# Altium project Metlino.PrjPcb (part 8 of 13)

## Sheet ETH_PHY_RGMII.SchDoc: Metlino
size 420 x 297 mm; CheckedBy: P.Kulik,T.Przywozki,W.Ruclo; Author: G.Kasprowicz; CompanyName: WUT ISE; DrawnBy: G.Kasprowicz; Organization: WUT ISE; Address1: PW ISE; Address2: Nowowiejska 15/19 00-665 Warsaw; Address3: gkasprow@gmail.com; DocumentNumber: 17; Revision: 2; SheetNumber: 17; SheetTotal: 29; ModifiedBy: -; CheckedDate: -; Title2: Ethernet PHY; DivGrp: WUT ISE; Designer: G.Kasprowicz; ModifiedDate: -; ProjectName: Sensor Box
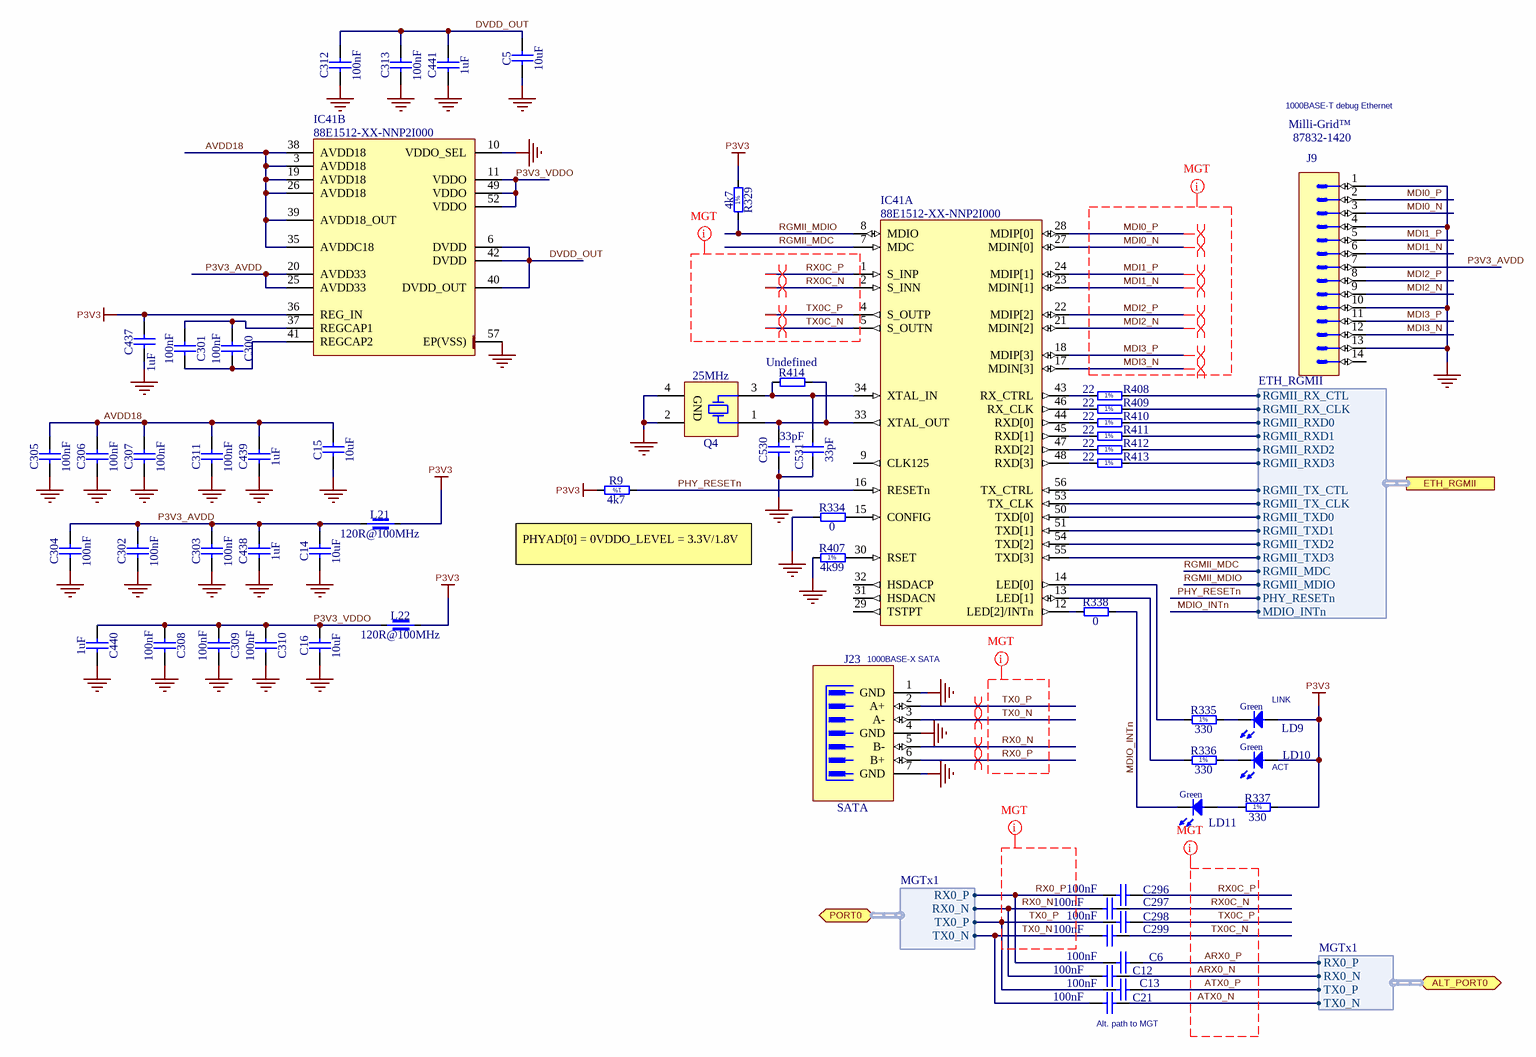
[diagram p16: ETH_PHY_RGMII.SchDoc]

### Parts
C5  10uF  [CAPC1608X87N]
C6  100nF  [CAPC0603X33N]
C12  100nF  [CAPC0603X33N]
C13  100nF  [CAPC0603X33N]
C14  10uF  [CAPC1608X87N]
C15  10uF  [CAPC1608X87N]
C16  10uF  [CAPC1608X87N]
C21  100nF  [CAPC0603X33N]
C296  100nF  [CAPC0603X33N]
C297  100nF  [CAPC0603X33N]
C298  100nF  [CAPC0603X33N]
C299  100nF  [CAPC0603X33N]
C300  100nF  [CAPC0603X33N]
C301  100nF  [CAPC0603X33N]
C302  100nF  [CAPC0603X33N]
C303  100nF  [CAPC0603X33N]
C304  100nF  [CAPC0603X33N]
C305  100nF  [CAPC0603X33N]
C306  100nF  [CAPC0603X33N]
C307  100nF  [CAPC0603X33N]
C308  100nF  [CAPC0603X33N]
C309  100nF  [CAPC0603X33N]
C310  100nF  [CAPC0603X33N]
C311  100nF  [CAPC0603X33N]
C312  100nF  [CAPC0603X33N]
C313  100nF  [CAPC0603X33N]
C437  1uF  [CAPC1005X55N]
C438  1uF  [CAPC1005X55N]
C439  1uF  [CAPC1005X55N]
C440  1uF  [CAPC1005X55N]
C441  1uF  [CAPC1005X55N]
C530  33pF  [CAPC1005X55N]
C531  33pF  [CAPC1005X55N]
IC41  88E1512-XX-NNP2I000  [QFN50P800X800X100-57N-S437]  (parts A,B of 2)
J9  Milli-Grid™  Manufacturer Part Number: 87832-1420  [MOLEX_87832-1420]
J23  SATA  [MOLEX_67800-5005]
L21  120R@100MHz  [INDC1005X55N]
L22  120R@100MHz  [INDC1005X55N]
LD9  Green  [LED_AVAGO_HSME-C120]
LD10  Green  [LED_AVAGO_HSME-C120]
LD11  Green  [LED_AVAGO_HSME-C120]
Q4  25MHz  [XTAL_TXC_8Y]
R9  4k7  [RESC1005X40N]
R329  4k7  [RESC1005X40N]
R334  0  [RESC1005X40N]
R335  330  [RESC1005X40N]
R336  330  [RESC1005X40N]
R337  330  [RESC1005X40N]
R338  0  [RESC1005X40N]
R407  4k99  [RESC1608X55N]
R408  22  [RESC1005X40N]
R409  22  [RESC1005X40N]
R410  22  [RESC1005X40N]
R411  22  [RESC1005X40N]
R412  22  [RESC1005X40N]
R413  22  [RESC1005X40N]
R414  Undefined  [RESC1005X40N]

### Ports
ALT_PORT0 (bidir, harness MGTx1), ETH_RGMII (harness ETH_RGMII), PORT0 (bidir, harness MGTx1)

### Harnesses
MGTx1: RX0_P, RX0_N, TX0_P, TX0_N
ETH_RGMII: RGMII_RX_CTL, RGMII_RX_CLK, RGMII_RXD0, RGMII_RXD1, RGMII_RXD2, RGMII_RXD3, RGMII_TX_CTL, RGMII_TX_CLK, RGMII_TXD0, RGMII_TXD1, RGMII_TXD2, RGMII_TXD3, RGMII_MDC, RGMII_MDIO, PHY_RESETn, MDIO_INTn

### Nets
GND: C5.1 C14.1 C15.1 C16.1 C302.1 C303.1 C304.1 C305.1 C306.1 C307.1 C308.1 C309.1 C310.1 C311.1 C312.1 C313.1 C437.1 C438.1 C439.1 C440.1 C441.1 C530.1 C531.1 IC41.10(VDDO_SEL) IC41.57(EP(VSS)) J9.1 J9.4 J9.10 J9.13 J23.1(GND) J23.4(GND) J23.7(GND) Q4.2(GND) Q4.4(GND) R334.1 R407.1
P3V3: C437.2 IC41.36(REG_IN) L21.2 L22.1 LD9.2(A) LD10.2(A) R9.2 R329.2 R337.2
ARX0_N: C12.2 ; port ALT_PORT0.RX0_N  [project net ALT_PORT0.RX0_N]
ARX0_P: C6.2 ; port ALT_PORT0.RX0_P  [project net ALT_PORT0.RX0_P]
ATX0_N: C21.2 ; port ALT_PORT0.TX0_N  [project net ALT_PORT0.TX0_N]
ATX0_P: C13.2 ; port ALT_PORT0.TX0_P  [project net ALT_PORT0.TX0_P]
AVDD18: C15.2 C305.2 C306.2 C307.2 C311.2 C439.2 IC41.3(AVDD18) IC41.19(AVDD18) IC41.26(AVDD18) IC41.35(AVDDC18) IC41.38(AVDD18) IC41.39(AVDD18_OUT)
DVDD_OUT: C5.2 C312.2 C313.2 C441.2 IC41.6(DVDD) IC41.40(DVDD_OUT) IC41.42(DVDD)
ETH_RGMII.RGMII_RX_CLK: R409.2 ; port ETH_RGMII.RGMII_RX_CLK
ETH_RGMII.RGMII_RX_CTL: R408.2 ; port ETH_RGMII.RGMII_RX_CTL
ETH_RGMII.RGMII_RXD0: R410.2 ; port ETH_RGMII.RGMII_RXD0
ETH_RGMII.RGMII_RXD1: R411.2 ; port ETH_RGMII.RGMII_RXD1
ETH_RGMII.RGMII_RXD2: R412.2 ; port ETH_RGMII.RGMII_RXD2
ETH_RGMII.RGMII_RXD3: R413.2 ; port ETH_RGMII.RGMII_RXD3
ETH_RGMII.RGMII_TX_CLK: IC41.53(TX_CLK) ; port ETH_RGMII.RGMII_TX_CLK
ETH_RGMII.RGMII_TX_CTL: IC41.56(TX_CTRL) ; port ETH_RGMII.RGMII_TX_CTL
ETH_RGMII.RGMII_TXD0: IC41.50(TXD[0]) ; port ETH_RGMII.RGMII_TXD0
ETH_RGMII.RGMII_TXD1: IC41.51(TXD[1]) ; port ETH_RGMII.RGMII_TXD1
ETH_RGMII.RGMII_TXD2: IC41.54(TXD[2]) ; port ETH_RGMII.RGMII_TXD2
ETH_RGMII.RGMII_TXD3: IC41.55(TXD[3]) ; port ETH_RGMII.RGMII_TXD3
MDI0_N: IC41.27(MDIN[0]) J9.3
MDI0_P: IC41.28(MDIP[0]) J9.2
MDI1_N: IC41.23(MDIN[1]) J9.6
MDI1_P: IC41.24(MDIP[1]) J9.5
MDI2_N: IC41.21(MDIN[2]) J9.9
MDI2_P: IC41.22(MDIP[2]) J9.8
MDI3_N: IC41.17(MDIN[3]) J9.12
MDI3_P: IC41.18(MDIP[3]) J9.11
MDIO_INTn: LD11.1(C) R338.2 ; port ETH_RGMII.MDIO_INTn  [project net ETH_RGMII.MDIO_INTn]
P3V3_AVDD: C14.2 C302.2 C303.2 C304.2 C438.2 IC41.20(AVDD33) IC41.25(AVDD33) J9.7 L21.1
P3V3_VDDO: C16.2 C308.2 C309.2 C310.2 C440.2 IC41.11(VDDO) IC41.49(VDDO) IC41.52(VDDO) L22.2
PHY_RESETn: IC41.16(RESETn) R9.1 ; port ETH_RGMII.PHY_RESETn  [project net ETH_RGMII.PHY_RESETn]
RGMII_MDC: IC41.7(MDC) ; port ETH_RGMII.RGMII_MDC  [project net ETH_RGMII.RGMII_MDC]
RGMII_MDIO: IC41.8(MDIO) R329.1 ; port ETH_RGMII.RGMII_MDIO  [project net ETH_RGMII.RGMII_MDIO]
RX0_N: C12.1 C297.1 J23.5(B-) ; port PORT0.RX0_N  [project net PORT0.RX0_N]
RX0_P: C6.1 C296.1 J23.6(B+) ; port PORT0.RX0_P  [project net PORT0.RX0_P]
RX0C_N: C297.2 IC41.2(S_INN)
RX0C_P: C296.2 IC41.1(S_INP)
TX0_N: C21.1 C299.1 J23.3(A-) ; port PORT0.TX0_N  [project net PORT0.TX0_N]
TX0_P: C13.1 C298.1 J23.2(A+) ; port PORT0.TX0_P  [project net PORT0.TX0_P]
TX0C_N: C299.2 IC41.5(S_OUTN)
TX0C_P: C298.2 IC41.4(S_OUTP)
NetC300_1: C300.1 C301.1 IC41.41(REGCAP2)
NetC300_2: C300.2 C301.2 IC41.37(REGCAP1)
NetC530_2: C530.2 IC41.33(XTAL_OUT) Q4.1(X) R414.2
NetC531_2: C531.2 IC41.34(XTAL_IN) Q4.3(X) R414.1
NetIC41_12: IC41.12(LED[2]/INTn) R338.1
NetIC41_13: IC41.13(LED[1]) R336.1
NetIC41_14: IC41.14(LED[0]) R335.1
NetIC41_15: IC41.15(CONFIG) R334.2
NetIC41_30: IC41.30(RSET) R407.2
NetIC41_43: IC41.43(RX_CTRL) R408.1
NetIC41_44: IC41.44(RXD[0]) R410.1
NetIC41_45: IC41.45(RXD[1]) R411.1
NetIC41_46: IC41.46(RX_CLK) R409.1
NetIC41_47: IC41.47(RXD[2]) R412.1
NetIC41_48: IC41.48(RXD[3]) R413.1
NetLD9_1: LD9.1(C) R335.2
NetLD10_1: LD10.1(C) R336.2
NetLD11_2: LD11.2(A) R337.1

Not connected (* = marked no-connect by the designer): IC41 9(CLK125) 29(TSTPT) 31(HSDACN) 32(HSDACP); J9 14

### Layout directives
net class MGT: ARX0_N, ARX0_P, ATX0_N, ATX0_P, MDI0_N, MDI0_P, MDI1_N, MDI1_P, MDI2_N, MDI2_P, MDI3_N, MDI3_P, RX0_N, RX0_P, RX0C_N, RX0C_P, TX0_N, TX0_P, TX0C_N, TX0C_P
differential pair: MDI0_N, MDI0_P, MDI1_N, MDI1_P, MDI2_N, MDI2_P, MDI3_N, MDI3_P, PORT0.RX0_N, PORT0.RX0_P, PORT0.TX0_N, PORT0.TX0_P, RX0C_N, RX0C_P, TX0C_N, TX0C_P

### Notes on the sheet
- 1000BASE-T debug Ethernet
- (near R9) PHYAD[0] = 0VDDO_LEVEL = 3.3V/1.8V
- 1000BASE-X SATA
- (near LD9) LINK
- (near LD10) ACT
- (near C21) Alt. path to MGT
- Project/Equipment
- Document
- Designer
- Drawn by
- Check.by
- Copyright WUT ISE 2018.
  This documentation describes Open Hardware and is licensed under the CERN OHL v.1.1. You may redistribute and modify this documentation under the terms of the CERN OHL v.1.1. (http://ohwr.org/CERNOHL). This documentation is distributed WITHOUT ANY EXPRESS OR IMPLIED WARRANTY, INCLUDING OF MERCHANTABILITY, SATISFACTORY QUALITY AND FITNESS FOR A PARTICULAR PURPOSE. Please see the CERN OHL v.1.1 for applicable conditions.
- Contact
- File
- Last Mod.
- Print Date
- Sheet
- Size
- A3
- of
- Rev
- (in symbol R0402_4K7_1%_0.0625W_100PPM) 1%
- (in symbol R0402_22R_1%_0.0625W_100PPM) 1%
- (in symbol R0402_330R_1%_0.0625W_100PPM) 1%
- (in symbol R0603_4K99_1%_0.063W_50PPM) 1%

### Library data of the parts
C5 C14-C16 = CC0603_10UF_6.3V_20%_X5R: Non-polarised capacitor; Manufacturer: GENERIC; Part Description: SMD Multilayer Chip Ceramic Capacitor; Manufacturer1 Part Number: C0603C106M9PAC; Tolerance: ±20%; Voltage: 6.3V; TC: X5R; Manufacturer Part Number: CC0603_10uF_6.3V_20%_X5R; Part Number: CC0603_10UF_6.3V_20%_X5R; Value: 10uF; Component Kind: Standard; Component Type: Standard; Pin Count: 2; Status: Preferred; Case: 0603; Mounted: Yes; Socket: No; SMD: Yes; Sense: No; Manufacturer1 Example: KEMET; Manufacturer1 ComponentHeight: 0.95mm; HelpURL: \\cern.ch\dfs\Applications\Altium\Datasheets\CC0603_X5R_KEMET.pdf; Author: CERN DEM JLC; CreateDate: 03.12.2007; LatestRevisionDate: 03.12.2007
C6 C12 C13 C21 C296-C313 = CC0201_100NF_6.3V_10%_X5R: Non-polarised capacitor; Manufacturer: GENERIC; Part Description: SMD Multilayer Chip Ceramic Capacitor; Manufacturer1 Part Number: 02016D104KAT2A; Tolerance: ±10%; Voltage: 6.3V; TC: X5R; Manufacturer Part Number: CC0201_100NF_6.3V_10%_X5R; Part Number: CC0201_100NF_6.3V_10%_X5R; Value: 100nF; Component Kind: Standard; Component Type: Standard; Pin Count: 2; Status: Not Recommended; Case: 0201; Mounted: Yes; Socket: No; SMD: Yes; Sense: No; Manufacturer1 Example: AVX; Manufacturer1 ComponentHeight: 0.33mm; HelpURL: \\cern.ch\dfs\Applications\Altium\Datasheets\CC0201_X5R_AVX.pdf; Author: CERN DEM JLC; CreateDate: 03.12.2007; LatestRevisionDate: 03.12.2007
C437-C441 = CC0402_1UF_16V_10%_X5R: Non-polarised capacitor; Manufacturer: GENERIC; Part Description: SMD Multilayer Chip Ceramic Capacitor; Manufacturer1 Part Number: C1005X5R1C105KT; Tolerance: ±10%; Voltage: 16V; TC: X5R; Manufacturer Part Number: CC0402_1UF_16V_10%_X5R; Part Number: CC0402_1UF_16V_10%_X5R; Value: 1uF; Component Kind: Standard; Component Type: Standard; Pin Count: 2; Status: Preferred; Case: 0402; Mounted: Yes; Socket: No; SMD: Yes; Sense: No; Manufacturer1 Example: TDK; Manufacturer1 ComponentHeight: 0.55mm; HelpURL: \\cern.ch\dfs\Applications\Altium\Datasheets\CC0402_X5R_TDK_C.pdf; Author: CERN DEM JLC; CreateDate: 25.10.2012; LatestRevisionDate: 25.10.2012
C530 C531 = CC0402_33PF_50V_5%_C0G: Non-polarised capacitor; Manufacturer: GENERIC; Part Description: SMD Multilayer Chip Ceramic Capacitor; Manufacturer1 Part Number: C0402C330J5GACTU; Tolerance: ±5%; Voltage: 50V; TC: C0G/NP0; Manufacturer Part Number: CC0402_33PF_50V_5%_C0G; Part Number: CC0402_33PF_50V_5%_C0G; Value: 33pF; Component Kind: Standard; Component Type: Standard; Pin Count: 2; Status: Preferred; Case: 0402; Mounted: Yes; Socket: No; SMD: Yes; Sense: No; Manufacturer1 Example: KEMET; Manufacturer1 ComponentHeight: 0.55mm; HelpURL: \\cern.ch\dfs\Applications\Altium\Datasheets\CC0805_C0G_KEMET_(Commercial Grade).pdf; Author: CERN DEM JLC; CreateDate: 03.12.2007; LatestRevisionDate: 22.04.2015
IC41 = 88E1512-XX-NNP2I000: Alaska Integrated 10/100/1000 Mbps Energy Efficient Ethernet Transceiver; Manufacturer: MARVELL  TECHNOLOGY; PressFit: No; Bonding: No; Manufacturer Part Number: 88E1512-XX-NNP2I000; PackageDescription: QFN, 0.50mm Pitch, Square; 56 Pin, 8.00mm L X 8.00mm W X 1.00mm H Body (4.37mm X 4.37mm Thermal Tab), IPC Medium Density; Part Description: Alaska Integrated 10/100/1000 Mbps Energy Efficient Ethernet Transceiver; Part Number: 88E1512-XX-NNP2I000; Component Kind: Standard; Component Type: Standard; Device: 88E1512-XX-NNP2I000; Pin Count: 57; Case: QFN56; Mounted: Yes; Socket: No; SMD: Yes; Sense: No; ComponentHeight: 1mm; Author: CERN DEM JLC; HelpURL: \\cern.ch\dfs\Applications\Altium\Datasheets\88E1512-XX-NNP2I000.pdf; CreateDate: 21.01.2015; LatestRevisionDate: 21.01.2015
J9 = MOLEX_87832-1420: Connector 14 Male; Manufacturer: MOLEX; Part Description: 2.00mm (.079") Pitch Milli-Grid™ Header, Surface Mount, Vertical, Shrouded, 14 Circuits,with Locking Windows and Centre Polarization Slot, PCB Locator; PressFit: No; Part Number: MOLEX_87832-1420; Component Kind: Standard; Component Type: Standard; Pin Count: 14; Family: Milli-Grid™; Mounted: Yes; Socket: No; SMD: Yes; Sense: No; Status: None; ComponentHeight: 7.6mm; HelpURL: \\cern.ch\dfs\Applications\Altium\Datasheets\MOLEX_87832-1420.pdf; Author: CERN DEM JLC; CreateDate: 09.09.2008; LatestRevisionDate: 09.09.2008
J23 = MOLEX_67800-5005: 7 Pin SATA Receptacle; Part Description: 1.27mm Pitch, 7 Contacts, Serial ATA High Speed Header, Straight with Locking Latch; Manufacturer: MOLEX; PressFit: No; Part Number: MOLEX_67800-5005; Component Kind: Standard; Component Type: Standard; Pin Count: 7; Family: SATA; Mounted: Yes; Socket: No; SMD: Yes; Sense: No; Status: None; Manufacturer Part Number: 67800-5005; ComponentHeight: 8.4mm; HelpURL: \\cern.ch\dfs\Applications\Altium\Datasheets\MOLEX_67800-5005.pdf; Author: CERN DEM MR; CreateDate: 01.12.2016; LatestRevisionDate: 01.12.2016
L21 L22 = IND0402_MURATA_BLM15PX121SN1D: Manufacturer: MURATA; Part Description: SMD EMIFIL Chip Ferrite Bead; Tolerance: ±25%; Power: 2A; Resistance: 0.055R; Manufacturer Part Number: BLM15PX121SN1D; Part Number: IND0402_MURATA_BLM15PX121SN1D; Value: 120R@100MHz; Component Kind: Standard; Component Type: Standard; Pin Count: 2; Status: None; Case: 0402; Mounted: Yes; Socket: No; SMD: Yes; Sense: No; ComponentHeight: 0.55mm; HelpURL: \\cern.ch\dfs\Applications\Altium\Datasheets\IND0402_MURATA_BLM15PX.pdf; Author: CERN DEM JMW; CreateDate: 19.02.2014; LatestRevisionDate: 25.10.2018
LD9-LD11 = LED_AVAGO_HSME-C120: LED Green 1C 2A; Manufacturer: AVAGO TECHNOLOGIES; Part Description: High Performance Right Angle Chip Green LED; PressFit: No; Bonding: No; Manufacturer Part Number: HSME-C120; PackageDescription: Green Chip LED, 2-Leads, Body 1.7x1.1mm, Side Emitting Package; Part Number: LED_AVAGO_HSME-C120; Component Kind: Standard; Component Type: Standard; Color: Green; Pin Count: 2; Mounted: Yes; Socket: No; SMD: Yes; Sense: No; ComponentHeight: 0.7mm; HelpURL: \\cern.ch\dfs\Applications\Altium\Datasheets\LED_AVAGO_HSME-C120.pdf; ComponentLink1URL: \\cern.ch\dfs\Applications\Altium\Datasheets\LED_AVAGO_HSME-C110_DESIGN-GUIDE.pdf; ComponentLink1Description: Design Guide; Author: CERN DEM JMW; CreateDate: 22.07.2009; LatestRevisionDate: 20.06.2012
Q4 = XTAL_25MHZ_TXC_8Y-25.000MAAJ-T: Crystal 4 pins 1=XTAL Control 2=GND3=XTAL 4=GND; Manufacturer: TXC CORPORATION; Part Description: ±30ppm 18pF -20°C to +70°C  4 Pins, 2x1.6X0.5mm, SMD Seam Sealing Crystal, 8Y Serie; PressFit: No; Bonding: No; Manufacturer Part Number: 8Y-25.000MAAJ-T; PackageDescription: 4 Pins, 2x1.6X0.5mm, SMD Seam Sealing Crystal, 8Y Serie; Part Number: XTAL_25MHZ_TXC_8Y-25.000MAAJ-T; Value: 25MHz; Component Kind: Standard; Component Type: Standard; Pin Count: 4; Mounted: Yes; Socket: No; SMD: Yes; Sense: No; ComponentHeight: 13.6mm; HelpURL: \\cern.ch\dfs\Applications\Altium\Datasheets\XTAL_TXC_8Y.pdf; Author: CERN DEM JLC; CreateDate: 08.03.2012; LatestRevisionDate: 08.03.2012
R9 R329 = R0402_4K7_1%_0.0625W_100PPM: Resistor - 1%; Manufacturer: GENERIC; Part Description: General Purpose Thick Film Chip Resistor; Manufacturer1 Part Number: 232270674702L; TC: ±100ppm/°C; PressFit: No; Manufacturer Part Number: R0402_4K7_1%_0.0625W_100PPM; Part Number: R0402_4K7_1%_0.0625W_100PPM; Tolerance: ±1%; Value: 4k7; Component Kind: Standard; Component Type: Standard; Pin Count: 2; Status: Not Recommended; Power: 0.0625W; Case: 0402; Mounted: Yes; Sense: No; Socket: No; SMD: Yes; Manufacturer1 Example: YAGEO PHYCOMP; Manufacturer1 ComponentHeight: 0.4mm; HelpURL: \\cern.ch\dfs\Applications\Altium\Datasheets\R0402_Phycomp_RC0402.pdf; Author: CERN DEM JLC; CreateDate: 03.12.2007; LatestRevisionDate: 17.10.2012
R334 R338 = R0402_0R_JUMPER: Resistor; Manufacturer: GENERIC; Part Description: 1A (0.05R Max DC Resistance) Zero Ohm Jumper; Manufacturer1 Part Number: 232270591001L; PressFit: No; Manufacturer Part Number: R0402_0R_JUMPER; Part Number: R0402_0R_JUMPER; Value: 0; Component Kind: Standard; Component Type: Standard; Pin Count: 2; Status: Not Recommended; Case: 0402; Mounted: Yes; Sense: No; Socket: No; SMD: Yes; Manufacturer1 Example: YAGEO PHYCOMP; Manufacturer1 ComponentHeight: 0.4mm; HelpURL: \\cern.ch\dfs\Applications\Altium\Datasheets\R0402_Phycomp_RC0402.pdf; Author: CERN DEM JLC; CreateDate: 03.12.2007; LatestRevisionDate: 17.10.2012
R335-R337 = R0402_330R_1%_0.0625W_100PPM: Resistor - 1%; Manufacturer: GENERIC; Part Description: General Purpose Thick Film Chip Resistor; Manufacturer1 Part Number: 232270673301L; TC: ±100ppm/°C; PressFit: No; Manufacturer Part Number: R0402_330R_1%_0.0625W_100PPM; Part Number: R0402_330R_1%_0.0625W_100PPM; Tolerance: ±1%; Value: 330; Component Kind: Standard; Component Type: Standard; Pin Count: 2; Status: Not Recommended; Power: 0.0625W; Case: 0402; Mounted: Yes; Sense: No; Socket: No; SMD: Yes; Manufacturer1 Example: YAGEO PHYCOMP; Manufacturer1 ComponentHeight: 0.4mm; HelpURL: \\cern.ch\dfs\Applications\Altium\Datasheets\R0402_Phycomp_RC0402.pdf; Author: CERN DEM JLC; CreateDate: 03.12.2007; LatestRevisionDate: 17.10.2012
R407 = R0603_4K99_1%_0.063W_50PPM: Resistor - 1%; Manufacturer: GENERIC; Part Description: General Purpose Thick Film Chip Resistor; Manufacturer1 Part Number: CPF0603F4K99C1; Power: 0.1W; TC: ±50ppm/°C; PressFit: No; Manufacturer Part Number: R0603_4K99_1%_0.063W_50PPM; Part Number: R0603_4K99_1%_0.063W_50PPM; Tolerance: ±1%; Value: 4k99; Component Kind: Standard; Component Type: Standard; Pin Count: 2; Status: None; Case: 0603; Mounted: Yes; Sense: No; Socket: No; SMD: Yes; Manufacturer1 Example: TYCO NEOHM; Manufacturer1 ComponentHeight: 0.55mm; HelpURL: \\cern.ch\dfs\Applications\Altium\Datasheets\R0603_TYCO_CPF.pdf; Author: CERN DEM JLC; CreateDate: 20.05.2010; LatestRevisionDate: 20.05.2010
R408-R413 = R0402_22R_1%_0.0625W_100PPM: Resistor - 1%; Manufacturer: GENERIC; Part Description: General Purpose Thick Film Chip Resistor; Manufacturer1 Part Number: 232270672209L; TC: ±100ppm/°C; PressFit: No; Manufacturer Part Number: R0402_22R_1%_0.0625W_100PPM; Part Number: R0402_22R_1%_0.0625W_100PPM; Tolerance: ±1%; Value: 22; Component Kind: Standard; Component Type: Standard; Pin Count: 2; Status: Not Recommended; Power: 0.0625W; Case: 0402; Mounted: Yes; Sense: No; Socket: No; SMD: Yes; Manufacturer1 Example: YAGEO PHYCOMP; Manufacturer1 ComponentHeight: 0.4mm; HelpURL: \\cern.ch\dfs\Applications\Altium\Datasheets\R0402_Phycomp_RC0402.pdf; Author: CERN DEM JLC; CreateDate: 03.12.2007; LatestRevisionDate: 17.10.2012
R414 = R0402_NO-VALUE: Resistor; Part Description: Reserved Footprint For a 0402 (1005) Chip Resistor; PressFit: No; Mounted: No; Manufacturer Part Number: R0402_NO-VALUE; Manufacturer: Undefined; Part Number: R0402_NO-VALUE; Value: Undefined; Component Kind: Standard; Component Type: Standard; Pin Count: 2; Status: None; Case: 0402; Sense: No; Socket: No; SMD: Yes; Manufacturer1 Example: Undefined; Manufacturer1 Part Number: Undefined; Manufacturer1 ComponentHeight: Undefined; HelpURL: Undefined; Author: CERN DEM JLC; CreateDate: 03.12.2007; LatestRevisionDate: 13.03.2008

## Sheet I2C_MUX.SchDoc: Metlino
size 420 x 297 mm; CheckedBy: P.Kulik,T.Przywozki,W.Ruclo; Author: G.Kasprowicz; CompanyName: WUT ISE; DrawnBy: G.Kasprowicz; Organization: WUT ISE; Address1: PW ISE; Address2: Nowowiejska 15/19 00-665 Warsaw; Address3: gkasprow@gmail.com; DocumentNumber: 23; Revision: 2; SheetNumber: 23; SheetTotal: 29; ModifiedBy: -; CheckedDate: -; Title2: I2C switch; DivGrp: WUT ISE; Designer: G.Kasprowicz; ModifiedDate: -; ProjectName: Sensor Box
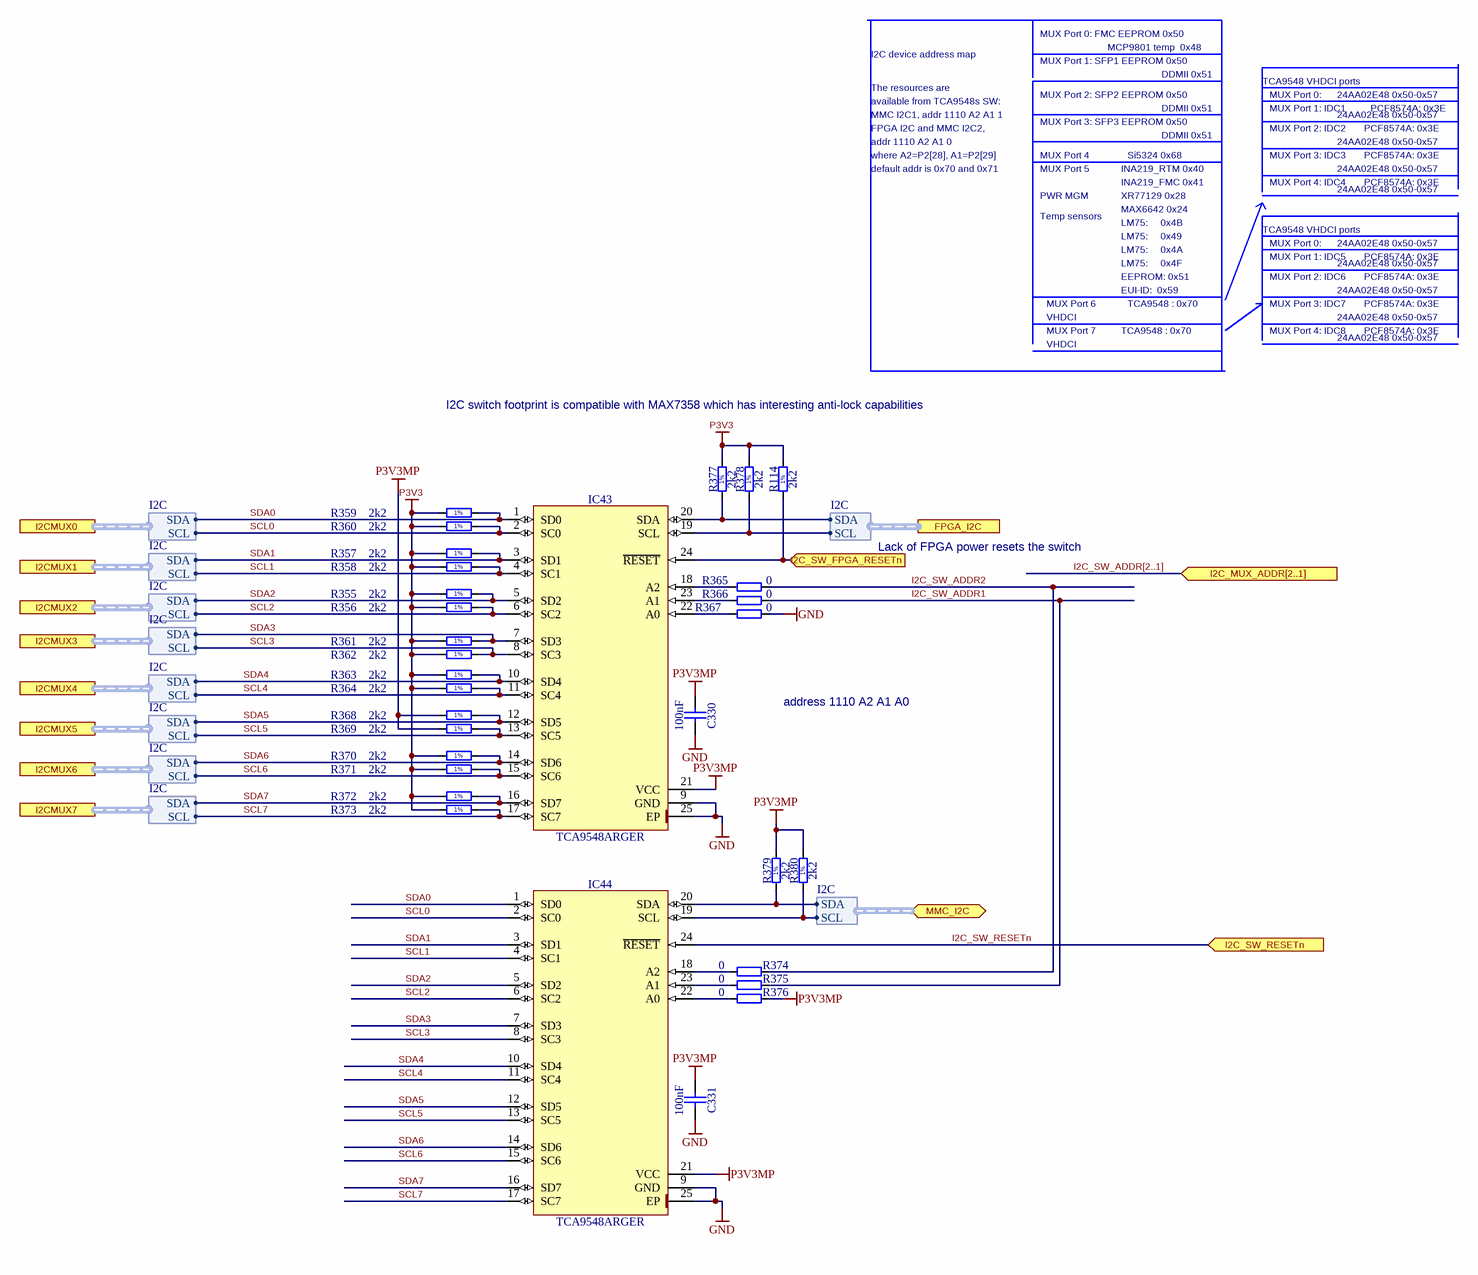
[diagram p17: I2C_MUX.SchDoc]

### Parts
C330  100nF  [CAPC0603X33N]
C331  100nF  [CAPC0603X33N]
IC43  TCA9548ARGER  [QFN50P400X400X100-25N-S220]
IC44  TCA9548ARGER  [QFN50P400X400X100-25N-S220]
R114  2k2  [RESC1005X40N]
R355  2k2  [RESC1005X40N]
R356  2k2  [RESC1005X40N]
R357  2k2  [RESC1005X40N]
R358  2k2  [RESC1005X40N]
R359  2k2  [RESC1005X40N]
R360  2k2  [RESC1005X40N]
R361  2k2  [RESC1005X40N]
R362  2k2  [RESC1005X40N]
R363  2k2  [RESC1005X40N]
R364  2k2  [RESC1005X40N]
R365  0  [RESC1005X40N]
R366  0  [RESC1005X40N]
R367  0  [RESC1005X40N]
R368  2k2  [RESC1005X40N]
R369  2k2  [RESC1005X40N]
R370  2k2  [RESC1005X40N]
R371  2k2  [RESC1005X40N]
R372  2k2  [RESC1005X40N]
R373  2k2  [RESC1005X40N]
R374  0  [RESC1005X40N]
R375  0  [RESC1005X40N]
R376  0  [RESC1005X40N]
R377  2k2  [RESC1005X40N]
R378  2k2  [RESC1005X40N]
R379  2k2  [RESC1005X40N]
R380  2k2  [RESC1005X40N]

### Ports
FPGA_I2C (harness I2C), I2C_MUX_ADDR[2..1] (in), I2C_SW_FPGA_RESETn (in), I2C_SW_RESETn (in), I2CMUX0 (harness I2C), I2CMUX1 (harness I2C), I2CMUX2 (harness I2C), I2CMUX3 (harness I2C), I2CMUX4 (harness I2C), I2CMUX5 (harness I2C), I2CMUX6 (harness I2C), I2CMUX7 (harness I2C), MMC_I2C (bidir, harness I2C)

### Harnesses
I2C: SCL, SDA

### Nets
GND: C330.2 C331.2 IC43.9(GND) IC43.25(EP) IC44.9(GND) IC44.25(EP) R367.1
P3V3: R114.2 R355.1 R356.1 R357.1 R358.1 R359.1 R360.1 R361.1 R362.1 R363.1 R364.1 R370.1 R371.1 R372.1 R373.1 R377.2 R378.2
P3V3MP: C330.1 C331.1 IC43.21(VCC) IC44.21(VCC) R368.1 R369.1 R376.1 R379.2 R380.2
FPGA_I2C_SCL: IC43.19(SCL) R378.1 ; port FPGA_I2C.SCL
FPGA_I2C_SDA: IC43.20(SDA) R377.1 ; port FPGA_I2C.SDA
I2C_SW_ADDR1: R366.1 R375.1  [project net I2C_MUX_ADDR1]
I2C_SW_ADDR2: R365.1 R374.1  [project net I2C_MUX_ADDR2]
I2C_SW_FPGA_RESETn: IC43.24(~{RESET}) R114.1 ; port I2C_SW_FPGA_RESETn
I2C_SW_RESETn: IC44.24(~{RESET}) ; port I2C_SW_RESETn
MMC_SCL: IC44.19(SCL) R380.1 ; port MMC_I2C.SCL
MMC_SDA: IC44.20(SDA) R379.1 ; port MMC_I2C.SDA
SCL0: IC43.2(SC0) IC44.2(SC0) R360.2 ; port I2CMUX0.SCL  [project net FMC_SCL]
SCL1: IC43.4(SC1) IC44.4(SC1) R358.2 ; port I2CMUX1.SCL
SCL2: IC43.6(SC2) IC44.6(SC2) R356.2 ; port I2CMUX2.SCL
SCL3: IC43.8(SC3) IC44.8(SC3) R362.2 ; port I2CMUX3.SCL
SCL4: IC43.11(SC4) IC44.11(SC4) R364.2 ; port I2CMUX4.SCL
SCL5: IC43.13(SC5) IC44.13(SC5) R369.2 ; port I2CMUX5.SCL  [project net PM_I2C.SCL]
SCL6: IC43.15(SC6) IC44.15(SC6) R371.2 ; port I2CMUX6.SCL
SCL7: IC43.17(SC7) IC44.17(SC7) R373.2 ; port I2CMUX7.SCL
SDA0: IC43.1(SD0) IC44.1(SD0) R359.2 ; port I2CMUX0.SDA  [project net FMC_SDA]
SDA1: IC43.3(SD1) IC44.3(SD1) R357.2 ; port I2CMUX1.SDA
SDA2: IC43.5(SD2) IC44.5(SD2) R355.2 ; port I2CMUX2.SDA
SDA3: IC43.7(SD3) IC44.7(SD3) R361.2 ; port I2CMUX3.SDA
SDA4: IC43.10(SD4) IC44.10(SD4) R363.2 ; port I2CMUX4.SDA
SDA5: IC43.12(SD5) IC44.12(SD5) R368.2 ; port I2CMUX5.SDA  [project net PM_I2C.SDA]
SDA6: IC43.14(SD6) IC44.14(SD6) R370.2 ; port I2CMUX6.SDA
SDA7: IC43.16(SD7) IC44.16(SD7) R372.2 ; port I2CMUX7.SDA
NetIC43_18: IC43.18(A2) R365.2
NetIC43_22: IC43.22(A0) R367.2
NetIC43_23: IC43.23(A1) R366.2
NetIC44_18: IC44.18(A2) R374.2
NetIC44_22: IC44.22(A0) R376.2
NetIC44_23: IC44.23(A1) R375.2

### Buses and harness runs
bus I2C_SW_ADDR[2..1] = port I2C_MUX_ADDR[2..1]

### Notes on the sheet
- The resources are
- I2C device address map
- MUX Port 0: FMC EEPROM 0x50
- MUX Port 1: SFP1 EEPROM 0x50
- MCP9801 temp  0x48
- DDMII 0x51
- TCA9548 VHDCI ports
- FPGA I2C and MMC I2C2,
- where A2=P2[28], A1=P2[29]
- available from TCA9548s SW:
- MMC I2C1, addr 1110 A2 A1 1
- addr 1110 A2 A1 0
- MUX Port 4
- MUX Port 2: SFP2 EEPROM 0x50
- MUX Port 3: SFP3 EEPROM 0x50
- Si5324 0x68
- MUX Port 1: IDC1
- MUX Port 0:
- MUX Port 3: IDC3
- MUX Port 2: IDC2
- 24AA02E48 0x50-0x57
- PCF8574A: 0x3E
- default addr is 0x70 and 0x71
- MUX Port 5
- PWR MGM
- Temp sensors
- XR77129 0x28
- INA219_FMC 0x41
- INA219_RTM 0x40
- MAX6642 0x24
- LM75:     0x4B
- MUX Port 4: IDC4
- EEPROM: 0x51
- EUI-ID:  0x59
- LM75:     0x4F
- LM75:     0x4A
- LM75:     0x49
- MUX Port 2: IDC6
- MUX Port 1: IDC5
- MUX Port 6
- MUX Port 7
- VHDCI
- TCA9548 : 0x70
- MUX Port 4: IDC8
- MUX Port 3: IDC7
- I2C switch footprint is compatible with MAX7358 which has interesting anti-lock capabilities
- Lack of FPGA power resets the switch
- address 1110 A2 A1 A0
- Project/Equipment
- Document
- Designer
- Drawn by
- Check.by
- Copyright WUT ISE 2018.
  This documentation describes Open Hardware and is licensed under the CERN OHL v.1.1. You may redistribute and modify this documentation under the terms of the CERN OHL v.1.1. (http://ohwr.org/CERNOHL). This documentation is distributed WITHOUT ANY EXPRESS OR IMPLIED WARRANTY, INCLUDING OF MERCHANTABILITY, SATISFACTORY QUALITY AND FITNESS FOR A PARTICULAR PURPOSE. Please see the CERN OHL v.1.1 for applicable conditions.
- Contact
- File
- Last Mod.
- Print Date
- Sheet
- Size
- A3
- of
- Rev
- (in symbol R0402_2K2_1%_0.0625W_100PPM) 1%

### Library data of the parts
C330 C331 = CC0201_100NF_6.3V_10%_X5R: as C6 on sheet ETH_PHY_RGMII; Manufacturer Part Number: CC0201_100NF_6.3V_10%_X5R; Part Number: CC0201_100NF_6.3V_10%_X5R; Value: 100nF; Component Kind: Standard; Component Type: Standard; Pin Count: 2; Status: Not Recommended; Case: 0201; Mounted: Yes; Socket: No; SMD: Yes; Sense: No; Manufacturer1 Example: AVX; Manufacturer1 ComponentHeight: 0.33mm; HelpURL: \\cern.ch\dfs\Applications\Altium\Datasheets\CC0201_X5R_AVX.pdf; Author: CERN DEM JLC; CreateDate: 03.12.2007; LatestRevisionDate: 03.12.2007
IC43 IC44 = TCA9548ARGER: Low Voltage 8-Channel I2C Switch With Reset; Manufacturer: TEXAS INSTRUMENTS; PressFit: No; Bonding: No; Manufacturer Part Number: TCA9548ARGER; PackageDescription: QFN, 0.50mm Pitch, Square; 24 Pin, 4.00mm L X 4.00mm W X 1.00mm H body (w/thermal tab 2.2 X 2.2mm), IPC Medium Density; Part Description: Low Voltage 8-Channel I2C Switch With Reset; Part Number: TCA9548ARGER; Component Kind: Standard; Component Type: Standard; Device: TCA9548ARGER; Pin Count: 25; Case: QFN24; Mounted: Yes; Socket: No; SMD: Yes; Sense: No; ComponentHeight: 1mm; Author: CERN DEM JLC; HelpURL: \\cern.ch\dfs\Applications\Altium\Datasheets\TCA9548ARGER.pdf; CreateDate: 07.07.2014; LatestRevisionDate: 07.07.2014
R114 R355-R364 R368-R373 R377-R380 = R0402_2K2_1%_0.0625W_100PPM: Resistor - 1%; Manufacturer: GENERIC; Part Description: General Purpose Thick Film Chip Resistor; Manufacturer1 Part Number: 232270672202L; TC: ±100ppm/°C; PressFit: No; Manufacturer Part Number: R0402_2K2_1%_0.0625W_100PPM; Part Number: R0402_2K2_1%_0.0625W_100PPM; Tolerance: ±1%; Value: 2k2; Component Kind: Standard; Component Type: Standard; Pin Count: 2; Status: Not Recommended; Power: 0.0625W; Case: 0402; Mounted: Yes; Sense: No; Socket: No; SMD: Yes; Manufacturer1 Example: YAGEO PHYCOMP; Manufacturer1 ComponentHeight: 0.4mm; HelpURL: \\cern.ch\dfs\Applications\Altium\Datasheets\R0402_Phycomp_RC0402.pdf; Author: CERN DEM JLC; CreateDate: 03.12.2007; LatestRevisionDate: 17.10.2012
R365-R367 R374-R376 = R0402_0R_JUMPER: as R334 on sheet ETH_PHY_RGMII; Manufacturer Part Number: R0402_0R_JUMPER; Part Number: R0402_0R_JUMPER; Value: 0; Component Kind: Standard; Component Type: Standard; Pin Count: 2; Status: Not Recommended; Case: 0402; Mounted: Yes; Sense: No; Socket: No; SMD: Yes; Manufacturer1 Example: YAGEO PHYCOMP; Manufacturer1 ComponentHeight: 0.4mm; HelpURL: \\cern.ch\dfs\Applications\Altium\Datasheets\R0402_Phycomp_RC0402.pdf; Author: CERN DEM JLC; CreateDate: 03.12.2007; LatestRevisionDate: 17.10.2012